# Altium schematic sheet lipo-charger.SchDoc
size A
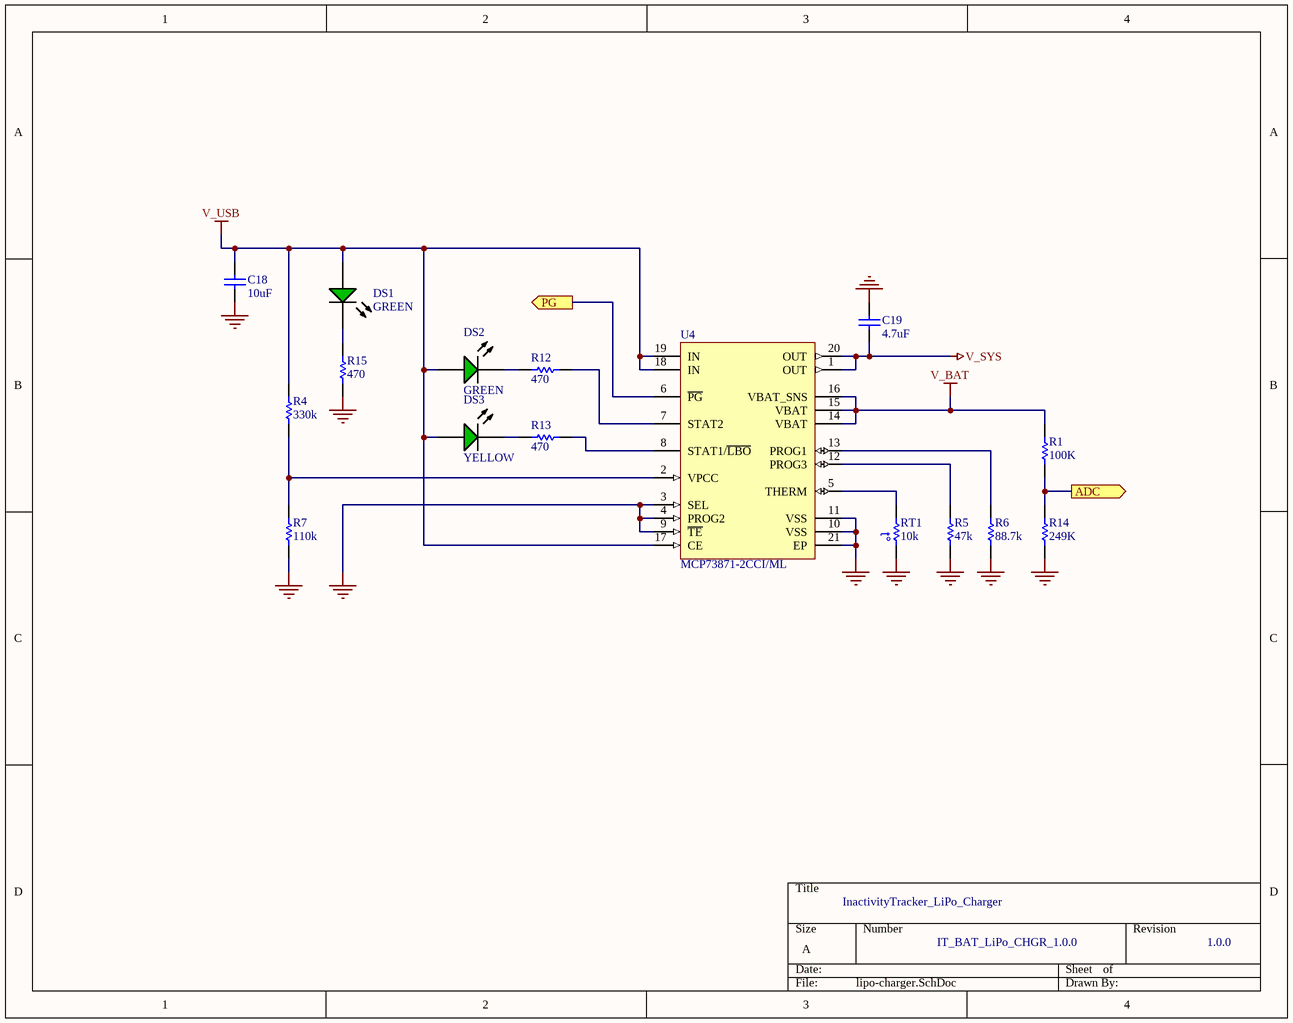
[diagram p0: lipo-charger.SchDoc]

## Parts
C18  10uF  [CAPC1005X55X25NL05T10]
C19  4.7uF  [CAPC1005X55X25NL05T10]
DS1  GREEN  [LITE-ON-LTST-C190GKT-2_V]
DS2  GREEN  [LITE-ON-LTST-C190GKT-2_V]
DS3  YELLOW  [LITE-ON-LTST-C190GKT-2_V]
R1  100K  [RESC1005X40X25ML05T05]
R4  330k  [RESC1005X40X25NL05T05]
R5  47k  [RESC1005X40X25LL05T05]
R6  88.7k  [RESC1005X40X25NL05T05]
R7  110k  [RESC1005X40X25NL05T05]
R12  470  [RESC1005X40X25ML05T05]
R13  470  [RESC1005X40X25ML05T05]
R14  249K  [RESC1005X40X25NL05T05]
R15  470  [RESC1005X40X25ML05T05]
RT1  10k  [MURA-NCP18XH103F03RB-2_V]
U4  MCP73871-2CCI/ML  [QFN-ML20_M]

## Ports
ADC (out), PG (out)

## Nets
GND: C18.2 C19.2 R5.2 R6.1 R7.2 R14.2 R15.2 RT1.2 U4.3(SEL) U4.4(PROG2) U4.9(~{TE}) U4.10(VSS) U4.11(VSS) U4.21(EP)
V_BAT: R1.1 U4.14(VBAT) U4.15(VBAT) U4.16(VBAT_SNS)
V_SYS: C19.1 U4.1(OUT) U4.20(OUT)
V_USB: C18.1 DS1.1(A) DS2.1(A) DS3.1(A) R4.1 U4.17(CE) U4.18(IN) U4.19(IN)
ADC: R1.2 R14.1 ; port ADC
PG: U4.6(~{PG}) ; port PG
NetDS1_2: DS1.2(K) R15.1
NetDS2_2: DS2.2(K) R12.1
NetDS3_2: DS3.2(K) R13.1
NetR4_2: R4.2 R7.1 U4.2(VPCC)
NetR5_1: R5.1 U4.12(PROG3)
NetR6_2: R6.2 U4.13(PROG1)
NetR12_2: R12.2 U4.7(STAT2)
NetR13_2: R13.2 U4.8(STAT1/~{LBO})
NetRT1_1: RT1.1 U4.5(THERM)

## Notes on the sheet
- InactivityTracker_LiPo_Charger
- IT_BAT_LiPo_CHGR_1.0.0
- 1.0.0
- (in symbol CMP-2000-05271-1) t°

## Library data of the parts
C18 = CMP-2008-04556-1: Part Number: GRM155R61A105KE15D; Manufacturer: Murata
C19 = CMP-2008-03967-1: Manufacturer: Murata; Part Number: GRM155R61C102KA01D
DS1-DS3 = CMP-2000-05197-1: LED Uni-Color Green, 75 mW, 5 V, -30 to 85 degC, 2-Pin SMD, RoHS, Tape and Reel; Manufacturer: Lite-On; Reverse Voltage: 5V; Product Depth (mm): 0.8mm; Forward Voltage: 2.4V; Rad Hardened: No; High Brightness: Yes; Forward Current: 30mA; Viewing Angle: 130deg; Test Current (It): 20mA; Emitting Color: YellowGreen; Number of Elements: 1; Luminous Intensity: 35mcd; Chip Material: AlGaInP; Shape Type: Rectangular; Dominant Wave Length: 571nm; Peak Wavelength: 574nm; Main Category: ChipLED; DELETED: Compliant; Product Length (mm): 1.6mm; Power Dissipation: 75W; Package Reference: C190KGKT; Mounting: SurfaceMount; Package Description: 2-Pin Surface Mount Device, Body 1.6 x 0.8 mm; Datasheet Version: Jul-15; Operating Temperature Classification: Industrial; Packaging: TapeandReel; Lens Dimensions: 1.1X0.8X0.52mm; Type: Uni-Color; Manufacturer URL: http://www.us.liteon.com/; Datasheet URL: http://datasheet.octopart.com/LTST-C190KGKT-Lite-On-datasheet-43775815.pdf; Product Height (mm): 0.8mm; Operating Temp Range: -55Cto85C; Pin Count: 2; Package Type: ChipLed; Lum Intensity: 35mcd
R1 = CMP-2002-08123-2: Chip Resistor, 100 KOhm, +/- 1%, 0.63 W, -55 to 155 degC, 0402 (1005 Metric), RoHS, Tape and Reel; Voltage Rating: 50 V; Type (Resistor): Thick Film; Power Rating: 63 mW; Case\Package: 0402; Mount: Surface Mount; Packaging: Tape and Reel; Weight: 2.3E-05 oz; PackageDescription: 2-Pin Surface Mount Device, Body 1 x 0.5 mm; ComponentLink1Description: Manufacturer URL; ComponentLink2Description: Datasheet; Min Operating Temperature: -55 degC; Width: 0.5 mm; Resistance: 100 kohm; REACH SVHC: Unknown; ComponentLink2URL: http://www.vishay.com/docs/20035/dcrcwe3.pdf; Package Quantity: 10000; Mounting Technology: Surface Mount; PackageReference: 0402; ComponentLink1URL: http://www.vishay.com/; Max Operating Temperature: 155 degC; Length: 1 mm; DatasheetVersion: 06/2012; Height: 0.35 mm; Case Code (Imperial): 0402; Pins: 2; Tolerance: 1%; Case Code (Metric): 1005; Radiation Hardening: No; RoHSCompliant: true
R4 = CMP-2002-08521-1: Manufacturer: Vishay Dale; Part Number: CRCW0402330KFKED
R5 = CMP-2002-00026-1: Manufacturer: Vishay Dale; Part Number: CRCW040247K0JNED
R6 = CMP-2002-00251-1: Manufacturer: Vishay Dale; Part Number: CRCW040288K7FKED
R7 = CMP-2002-08148-1: Manufacturer: Vishay Dale; Part Number: CRCW0402110KFKED
R12 R13 R15 = CMP-2002-00023-1: Part Number: CRCW0402470RJNED; Manufacturer: Vishay Dale
R14 = CMP-2002-08401-1: Part Number: CRCW0402249KFKED; Manufacturer: Vishay Dale
RT1 = CMP-2000-05271-1: NTC Thermistor, 10 KOhm, +/- 1%, 0.1 W, -40 to 125 degC, 0603 (1608 Metric), RoHS, Tape and Reel; Manufacturer: Murata; B-constant: 3434K; Resistance: 10kO; Rated Current: 310A; Datasheet URL: http://www.jameco.com/Jameco/Products/ProdDS/1870999.pdf; Datasheet Version: Apr-05; Temperature Range: -40to+125degC; Tolerance (%): ±1%; Manufacturer URL: http://www.murata.com/; Type: NTC
U4 = CMP-0133-00005-1: Stand-Alone System Load Sharing and Li-Ion/Li-Polymer Battery Charge Management Controller, 4.2V, 20-Pin QFN, Industrial Temperature; PackageDescription: 20-Lead Plastic Quad Flat, No Lead Package (ML) - 4x4x0.9 mm Body [QFN]; PackageReference: QFN-ML20; PackageVersion: revBB, Aug-2009; DatasheetVersion: revB, May-2009